# Altium schematic sheet PLEN_Control_Logic_pt2.SchDoc
size 420 x 594 mm; Author: ALTIUM GOSTBOM2.0 KEV
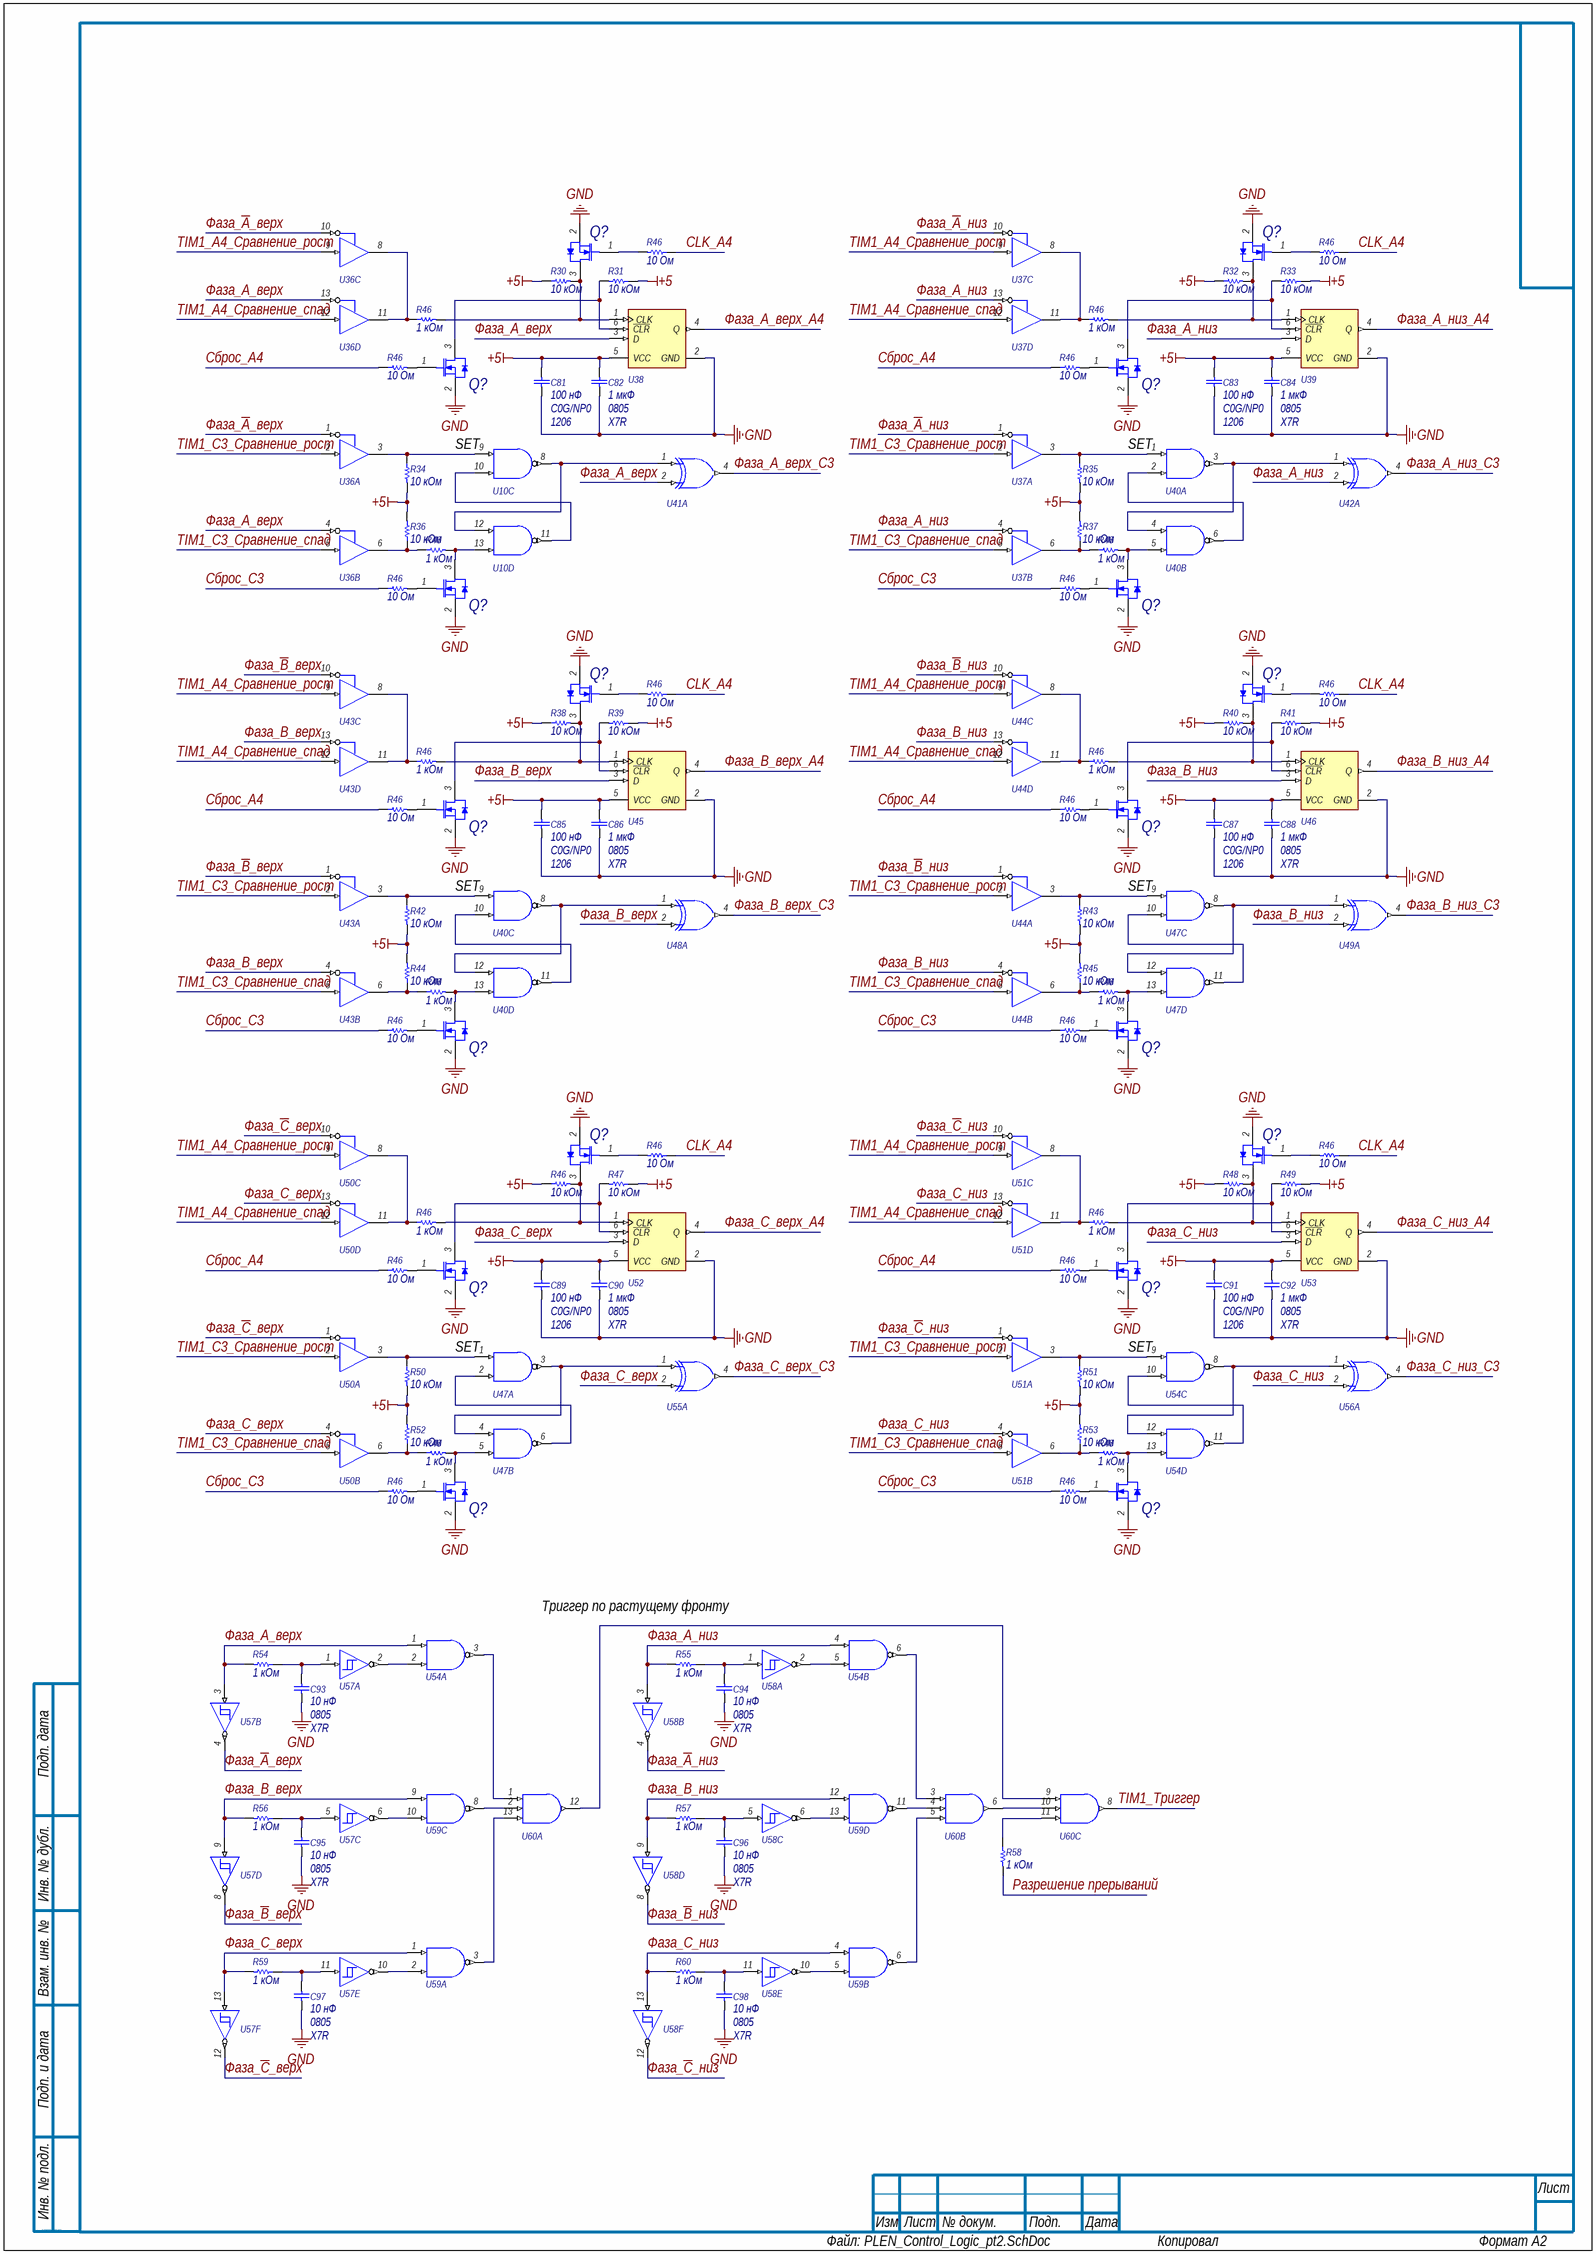
[diagram p0: PLEN_Control_Logic_pt2.SchDoc]

## Parts
(Parts that share a designator on the sheet are numbered #1, #2 ... from top to bottom, then left to right.)
C81  value 100 нФ  Dielectric Characteristic: C0G/NP0  Package Reference: 1206  [CAPC3216X180X55NL20T25]  (hidden comment: GRM31C5C1E104JA01L)
C82  value 1 мкФ  Case: 0805  Dielectric: X7R  [CAPC2013X140X50LL20T25]  (hidden comment: C0805C105K3RACTU)
C83  value 100 нФ  Dielectric Characteristic: C0G/NP0  Package Reference: 1206  [CAPC3216X180X55NL20T25]  (hidden comment: GRM31C5C1E104JA01L)
C84  value 1 мкФ  Case: 0805  Dielectric: X7R  [CAPC2013X140X50LL20T25]  (hidden comment: C0805C105K3RACTU)
C85  value 100 нФ  Dielectric Characteristic: C0G/NP0  Package Reference: 1206  [CAPC3216X180X55NL20T25]  (hidden comment: GRM31C5C1E104JA01L)
C86  value 1 мкФ  Case: 0805  Dielectric: X7R  [CAPC2013X140X50LL20T25]  (hidden comment: C0805C105K3RACTU)
C87  value 100 нФ  Dielectric Characteristic: C0G/NP0  Package Reference: 1206  [CAPC3216X180X55NL20T25]  (hidden comment: GRM31C5C1E104JA01L)
C88  value 1 мкФ  Case: 0805  Dielectric: X7R  [CAPC2013X140X50LL20T25]  (hidden comment: C0805C105K3RACTU)
C89  value 100 нФ  Dielectric Characteristic: C0G/NP0  Package Reference: 1206  [CAPC3216X180X55NL20T25]  (hidden comment: GRM31C5C1E104JA01L)
C90  value 1 мкФ  Case: 0805  Dielectric: X7R  [CAPC2013X140X50LL20T25]  (hidden comment: C0805C105K3RACTU)
C91  value 100 нФ  Dielectric Characteristic: C0G/NP0  Package Reference: 1206  [CAPC3216X180X55NL20T25]  (hidden comment: GRM31C5C1E104JA01L)
C92  value 1 мкФ  Case: 0805  Dielectric: X7R  [CAPC2013X140X50LL20T25]  (hidden comment: C0805C105K3RACTU)
C93  value 10 нФ  Case: 0805  Dielectric: X7R  [CAPC2013X140X50LL20T25]  (hidden comment: C0805C105K3RACTU)
C94  value 10 нФ  Case: 0805  Dielectric: X7R  [CAPC2013X140X50LL20T25]  (hidden comment: C0805C105K3RACTU)
C95  value 10 нФ  Case: 0805  Dielectric: X7R  [CAPC2013X140X50LL20T25]  (hidden comment: C0805C105K3RACTU)
C96  value 10 нФ  Case: 0805  Dielectric: X7R  [CAPC2013X140X50LL20T25]  (hidden comment: C0805C105K3RACTU)
C97  value 10 нФ  Case: 0805  Dielectric: X7R  [CAPC2013X140X50LL20T25]  (hidden comment: C0805C105K3RACTU)
C98  value 10 нФ  Case: 0805  Dielectric: X7R  [CAPC2013X140X50LL20T25]  (hidden comment: C0805C105K3RACTU)
Q?#1  2N7002  [INF-PG-SOT23_N]  (value not drawn)
Q?#2  2N7002  [INF-PG-SOT23_N]  (value not drawn)
Q?#3  2N7002  [INF-PG-SOT23_N]  (value not drawn)
Q?#4  2N7002  [INF-PG-SOT23_N]  (value not drawn)
Q?#5  2N7002  [INF-PG-SOT23_N]  (value not drawn)
Q?#6  2N7002  [INF-PG-SOT23_N]  (value not drawn)
Q?#7  2N7002  [INF-PG-SOT23_N]  (value not drawn)
Q?#8  2N7002  [INF-PG-SOT23_N]  (value not drawn)
Q?#9  2N7002  [INF-PG-SOT23_N]  (value not drawn)
Q?#10  2N7002  [INF-PG-SOT23_N]  (value not drawn)
Q?#11  2N7002  [INF-PG-SOT23_N]  (value not drawn)
Q?#12  2N7002  [INF-PG-SOT23_N]  (value not drawn)
Q?#13  2N7002  [INF-PG-SOT23_N]  (value not drawn)
Q?#14  2N7002  [INF-PG-SOT23_N]  (value not drawn)
Q?#15  2N7002  [INF-PG-SOT23_N]  (value not drawn)
Q?#16  2N7002  [INF-PG-SOT23_N]  (value not drawn)
Q?#17  2N7002  [INF-PG-SOT23_N]  (value not drawn)
Q?#18  2N7002  [INF-PG-SOT23_N]  (value not drawn)
R30  value 10 кОм  [RESC2013X60X40ML20T25]  (hidden comment: ERA6AEB101V)
R31  value 10 кОм  [RESC2013X60X40ML20T25]  (hidden comment: ERA6AEB101V)
R32  value 10 кОм  [RESC2013X60X40ML20T25]  (hidden comment: ERA6AEB101V)
R33  value 10 кОм  [RESC2013X60X40ML20T25]  (hidden comment: ERA6AEB101V)
R34  value 10 кОм  [RESC2013X60X40ML20T25]  (hidden comment: ERA6AEB101V)
R35  value 10 кОм  [RESC2013X60X40ML20T25]  (hidden comment: ERA6AEB101V)
R36  value 10 кОм  [RESC2013X60X40ML20T25]  (hidden comment: ERA6AEB101V)
R37  value 10 кОм  [RESC2013X60X40ML20T25]  (hidden comment: ERA6AEB101V)
R38  value 10 кОм  [RESC2013X60X40ML20T25]  (hidden comment: ERA6AEB101V)
R39  value 10 кОм  [RESC2013X60X40ML20T25]  (hidden comment: ERA6AEB101V)
R40  value 10 кОм  [RESC2013X60X40ML20T25]  (hidden comment: ERA6AEB101V)
R41  value 10 кОм  [RESC2013X60X40ML20T25]  (hidden comment: ERA6AEB101V)
R42  value 10 кОм  [RESC2013X60X40ML20T25]  (hidden comment: ERA6AEB101V)
R43  value 10 кОм  [RESC2013X60X40ML20T25]  (hidden comment: ERA6AEB101V)
R44  value 10 кОм  [RESC2013X60X40ML20T25]  (hidden comment: ERA6AEB101V)
R45  value 10 кОм  [RESC2013X60X40ML20T25]  (hidden comment: ERA6AEB101V)
R46#1  value 10 Ом  [RESC2013X60X40ML20T25]  (hidden comment: ERA6AEB101V)
R46#2  value 10 Ом  [RESC2013X60X40ML20T25]  (hidden comment: ERA6AEB101V)
R46#3  value 1 кОм  [RESC2013X60X40ML20T25]  (hidden comment: ERA6AEB101V)
R46#4  value 1 кОм  [RESC2013X60X40ML20T25]  (hidden comment: ERA6AEB101V)
R46#5  value 10 Ом  [RESC2013X60X40ML20T25]  (hidden comment: ERA6AEB101V)
R46#6  value 10 Ом  [RESC2013X60X40ML20T25]  (hidden comment: ERA6AEB101V)
R46#7  value 1 кОм  [RESC2013X60X40ML20T25]  (hidden comment: ERA6AEB101V)
R46#8  value 1 кОм  [RESC2013X60X40ML20T25]  (hidden comment: ERA6AEB101V)
R46#9  value 10 Ом  [RESC2013X60X40ML20T25]  (hidden comment: ERA6AEB101V)
R46#10  value 10 Ом  [RESC2013X60X40ML20T25]  (hidden comment: ERA6AEB101V)
R46#11  value 10 Ом  [RESC2013X60X40ML20T25]  (hidden comment: ERA6AEB101V)
R46#12  value 10 Ом  [RESC2013X60X40ML20T25]  (hidden comment: ERA6AEB101V)
R46#13  value 1 кОм  [RESC2013X60X40ML20T25]  (hidden comment: ERA6AEB101V)
R46#14  value 1 кОм  [RESC2013X60X40ML20T25]  (hidden comment: ERA6AEB101V)
R46#15  value 10 Ом  [RESC2013X60X40ML20T25]  (hidden comment: ERA6AEB101V)
R46#16  value 10 Ом  [RESC2013X60X40ML20T25]  (hidden comment: ERA6AEB101V)
R46#17  value 1 кОм  [RESC2013X60X40ML20T25]  (hidden comment: ERA6AEB101V)
R46#18  value 1 кОм  [RESC2013X60X40ML20T25]  (hidden comment: ERA6AEB101V)
R46#19  value 10 Ом  [RESC2013X60X40ML20T25]  (hidden comment: ERA6AEB101V)
R46#20  value 10 Ом  [RESC2013X60X40ML20T25]  (hidden comment: ERA6AEB101V)
R46#21  value 10 Ом  [RESC2013X60X40ML20T25]  (hidden comment: ERA6AEB101V)
R46#22  value 10 Ом  [RESC2013X60X40ML20T25]  (hidden comment: ERA6AEB101V)
R46#23  value 10 кОм  [RESC2013X60X40ML20T25]  (hidden comment: ERA6AEB101V)
R46#24  value 1 кОм  [RESC2013X60X40ML20T25]  (hidden comment: ERA6AEB101V)
R46#25  value 1 кОм  [RESC2013X60X40ML20T25]  (hidden comment: ERA6AEB101V)
R46#26  value 10 Ом  [RESC2013X60X40ML20T25]  (hidden comment: ERA6AEB101V)
R46#27  value 10 Ом  [RESC2013X60X40ML20T25]  (hidden comment: ERA6AEB101V)
R46#28  value 1 кОм  [RESC2013X60X40ML20T25]  (hidden comment: ERA6AEB101V)
R46#29  value 1 кОм  [RESC2013X60X40ML20T25]  (hidden comment: ERA6AEB101V)
R46#30  value 10 Ом  [RESC2013X60X40ML20T25]  (hidden comment: ERA6AEB101V)
R46#31  value 10 Ом  [RESC2013X60X40ML20T25]  (hidden comment: ERA6AEB101V)
R47  value 10 кОм  [RESC2013X60X40ML20T25]  (hidden comment: ERA6AEB101V)
R48  value 10 кОм  [RESC2013X60X40ML20T25]  (hidden comment: ERA6AEB101V)
R49  value 10 кОм  [RESC2013X60X40ML20T25]  (hidden comment: ERA6AEB101V)
R50  value 10 кОм  [RESC2013X60X40ML20T25]  (hidden comment: ERA6AEB101V)
R51  value 10 кОм  [RESC2013X60X40ML20T25]  (hidden comment: ERA6AEB101V)
R52  value 10 кОм  [RESC2013X60X40ML20T25]  (hidden comment: ERA6AEB101V)
R53  value 10 кОм  [RESC2013X60X40ML20T25]  (hidden comment: ERA6AEB101V)
R54  value 1 кОм  [RESC2013X60X40ML20T25]  (hidden comment: ERA6AEB101V)
R55  value 1 кОм  [RESC2013X60X40ML20T25]  (hidden comment: ERA6AEB101V)
R56  value 1 кОм  [RESC2013X60X40ML20T25]  (hidden comment: ERA6AEB101V)
R57  value 1 кОм  [RESC2013X60X40ML20T25]  (hidden comment: ERA6AEB101V)
R58  value 1 кОм  [RESC2013X60X40ML20T25]  (hidden comment: ERA6AEB101V)
R59  value 1 кОм  [RESC2013X60X40ML20T25]  (hidden comment: ERA6AEB101V)
R60  value 1 кОм  [RESC2013X60X40ML20T25]  (hidden comment: ERA6AEB101V)
U10  SN74HC00DT  [D0014A_N]  (value not drawn)  (parts C,D of 5)
U36  SN74HC125DRG4  [D0014A_N]  (value not drawn)  (parts A,B,C,D of 5)
U37  SN74HC125DRG4  [D0014A_N]  (value not drawn)  (parts A,B,C,D of 5)
U38  SN74LVC1G175DCKR  [DCK0006A_N]  (value not drawn)
U39  SN74LVC1G175DCKR  [DCK0006A_N]  (value not drawn)
U40  SN74HC00DT  [D0014A_N]  (value not drawn)  (parts A,B,C,D of 5)
U41  SN74AHC1G86DBVR  [DBV0005A_N]  (value not drawn)  (part A of 2)
U42  SN74AHC1G86DBVR  [DBV0005A_N]  (value not drawn)  (part A of 2)
U43  SN74HC125DRG4  [D0014A_N]  (value not drawn)  (parts A,B,C,D of 5)
U44  SN74HC125DRG4  [D0014A_N]  (value not drawn)  (parts A,B,C,D of 5)
U45  SN74LVC1G175DCKR  [DCK0006A_N]  (value not drawn)
U46  SN74LVC1G175DCKR  [DCK0006A_N]  (value not drawn)
U47  SN74HC00DT  [D0014A_N]  (value not drawn)  (parts A,B,C,D of 5)
U48  SN74AHC1G86DBVR  [DBV0005A_N]  (value not drawn)  (part A of 2)
U49  SN74AHC1G86DBVR  [DBV0005A_N]  (value not drawn)  (part A of 2)
U50  SN74HC125DRG4  [D0014A_N]  (value not drawn)  (parts A,B,C,D of 5)
U51  SN74HC125DRG4  [D0014A_N]  (value not drawn)  (parts A,B,C,D of 5)
U52  SN74LVC1G175DCKR  [DCK0006A_N]  (value not drawn)
U53  SN74LVC1G175DCKR  [DCK0006A_N]  (value not drawn)
U54  SN74HC00DT  [D0014A_N]  (value not drawn)  (parts A,B,C,D of 5)
U55  SN74AHC1G86DBVR  [DBV0005A_N]  (value not drawn)  (part A of 2)
U56  SN74AHC1G86DBVR  [DBV0005A_N]  (value not drawn)  (part A of 2)
U57  SN74HC14DRG4  [D0014A_N]  (value not drawn)  (parts A,B,C,D,E,F of 7)
U58  SN74HC14DRG4  [D0014A_N]  (value not drawn)  (parts A,B,C,D,E,F of 7)
U59  SN74HC00DT  [D0014A_N]  (value not drawn)  (parts A,B,C,D of 5)
U60  CD74HC11M  [D0014A_N]  (value not drawn)  (parts A,B,C of 4)

## Nets
+5: C81.1 C82.2 C83.1 C84.2 C85.1 C86.2 C87.1 C88.2 C89.1 C90.2 C91.1 C92.2 R30.1 R31.1 R32.1 R33.1 R34.2 R35.2 R36.2 R37.2 R38.1 R39.1 R40.1 R41.1 R42.2 R43.2 R44.2 R45.2 R46#23.1 R47.1 R48.1 R49.1 R50.2 R51.2 R52.2 R53.2 U38.5(VCC) U39.5(VCC) U45.5(VCC) U46.5(VCC) U52.5(VCC) U53.5(VCC)
GND: C81.2 C82.1 C83.2 C84.1 C85.2 C86.1 C87.2 C88.1 C89.2 C90.1 C91.2 C92.1 C93.2 C94.2 C95.2 C96.2 C97.2 C98.2 Q?#1.2(SOURCE) Q?#2.2(SOURCE) Q?#3.2(SOURCE) Q?#4.2(SOURCE) Q?#5.2(SOURCE) Q?#6.2(SOURCE) Q?#7.2(SOURCE) Q?#8.2(SOURCE) Q?#9.2(SOURCE) Q?#10.2(SOURCE) Q?#11.2(SOURCE) Q?#12.2(SOURCE) Q?#13.2(SOURCE) Q?#14.2(SOURCE) Q?#15.2(SOURCE) Q?#16.2(SOURCE) Q?#17.2(SOURCE) Q?#18.2(SOURCE) U38.2(GND) U39.2(GND) U45.2(GND) U46.2(GND) U52.2(GND) U53.2(GND)
CLK_A4: R46#1.1 R46#2.1 R46#11.1 R46#12.1 R46#21.1 R46#22.1
TIM1_C3_Сравнение_рост: U36.2(1A) U37.2(1A) U43.2(1A) U44.2(1A) U50.2(1A) U51.2(1A)
TIM1_C3_Сравнение_спад: U36.5(2A) U37.5(2A) U43.5(2A) U44.5(2A) U50.5(2A) U51.5(2A)
TIM1_А4_Сравнение_рост: U36.9(3A) U37.9(3A) U43.9(3A) U44.9(3A) U50.9(3A) U51.9(3A)
TIM1_А4_Сравнение_спад: U36.12(4A) U37.12(4A) U43.12(4A) U44.12(4A) U50.12(4A) U51.12(4A)
TIM1_Триггер: U60.8(3Y)
Разрешение прерываний: R58.2
Сброс_A4: R46#5.1 R46#6.1 R46#15.1 R46#16.1 R46#26.1 R46#27.1
Сброс_C3: R46#9.1 R46#10.1 R46#19.1 R46#20.1 R46#30.1 R46#31.1
Фаза_~{A}_низ: U37.1(1~{OE}) U37.10(3~{OE})
Фаза_A_низ: U37.4(2~{OE}) U37.13(4~{OE}) U42.2(B)
Фаза_A_низ_A4: U39.4(Q)
Фаза_A_низ_C3: U42.4(Y)
Фаза_~{B}_верх: U43.1(1~{OE}) U43.10(3~{OE}) U57.8(~{4Y})
Фаза_~{B}_низ: U44.1(1~{OE}) U44.10(3~{OE}) U58.8(~{4Y})
Фаза_B_верх: R56.2 U43.4(2~{OE}) U43.13(4~{OE}) U45.3(D) U48.2(B) U57.9(4A) U59.9(3A)
Фаза_B_верх_A4: U45.4(Q)
Фаза_B_верх_C3: U48.4(Y)
Фаза_B_низ: R57.2 U44.4(2~{OE}) U44.13(4~{OE}) U46.3(D) U49.2(B) U58.9(4A) U59.12(4A)
Фаза_B_низ_A4: U46.4(Q)
Фаза_B_низ_C3: U49.4(Y)
Фаза_~{C}_верх: U50.1(1~{OE}) U50.10(3~{OE}) U57.12(~{6Y})
Фаза_~{C}_низ: U51.1(1~{OE}) U51.10(3~{OE}) U58.12(~{6Y})
Фаза_C_верх: R59.2 U50.4(2~{OE}) U50.13(4~{OE}) U52.3(D) U55.2(B) U57.13(6A) U59.1(1A)
Фаза_C_верх_A4: U52.4(Q)
Фаза_C_верх_C3: U55.4(Y)
Фаза_C_низ: R60.2 U51.4(2~{OE}) U51.13(4~{OE}) U53.3(D) U56.2(B) U58.13(6A) U59.4(2A)
Фаза_C_низ_A4: U53.4(Q)
Фаза_C_низ_C3: U56.4(Y)
Фаза_~{А}_верх: U36.1(1~{OE}) U36.10(3~{OE}) U57.4(~{2Y})
Фаза_~{А}_низ: U58.4(~{2Y})
Фаза_А_верх: R54.2 U36.4(2~{OE}) U36.13(4~{OE}) U38.3(D) U41.2(B) U54.1(1A) U57.3(2A)
Фаза_А_верх_A4: U38.4(Q)
Фаза_А_верх_C3: U41.4(Y)
Фаза_А_низ: R55.2 U39.3(D) U54.4(2A) U58.3(2A)
NetC93_1: C93.1 R54.1 U57.1(1A)
NetC94_1: C94.1 R55.1 U58.1(1A)
NetC95_1: C95.1 R56.1 U57.5(3A)
NetC96_1: C96.1 R57.1 U58.5(3A)
NetC97_1: C97.1 R59.1 U57.11(5A)
NetC98_1: C98.1 R60.1 U58.11(5A)
NetQ?#1_1: Q?#1.1(GATE) R46#1.2
NetQ?#1_3: Q?#1.3(DRAIN) R30.2 R46#3.2 U38.1(CLK)
NetQ?#2_1: Q?#2.1(GATE) R46#2.2
NetQ?#2_3: Q?#2.3(DRAIN) R32.2 R46#4.2 U39.1(CLK)
NetQ?#3_1: Q?#3.1(GATE) R46#5.2
NetQ?#3_3: Q?#3.3(DRAIN) R31.2 U38.6(~{CLR})
NetQ?#4_1: Q?#4.1(GATE) R46#6.2
NetQ?#4_3: Q?#4.3(DRAIN) R33.2 U39.6(~{CLR})
NetQ?#5_1: Q?#5.1(GATE) R46#9.2
NetQ?#5_3: Q?#5.3(DRAIN) R46#7.2 U10.13(4B)
NetQ?#6_1: Q?#6.1(GATE) R46#10.2
NetQ?#6_3: Q?#6.3(DRAIN) R46#8.2 U40.5(2B)
NetQ?#7_1: Q?#7.1(GATE) R46#11.2
NetQ?#7_3: Q?#7.3(DRAIN) R38.2 R46#13.2 U45.1(CLK)
NetQ?#8_1: Q?#8.1(GATE) R46#12.2
NetQ?#8_3: Q?#8.3(DRAIN) R40.2 R46#14.2 U46.1(CLK)
NetQ?#9_1: Q?#9.1(GATE) R46#15.2
NetQ?#9_3: Q?#9.3(DRAIN) R39.2 U45.6(~{CLR})
NetQ?#10_1: Q?#10.1(GATE) R46#16.2
NetQ?#10_3: Q?#10.3(DRAIN) R41.2 U46.6(~{CLR})
NetQ?#11_1: Q?#11.1(GATE) R46#19.2
NetQ?#11_3: Q?#11.3(DRAIN) R46#17.2 U40.13(4B)
NetQ?#12_1: Q?#12.1(GATE) R46#20.2
NetQ?#12_3: Q?#12.3(DRAIN) R46#18.2 U47.13(4B)
NetQ?#13_1: Q?#13.1(GATE) R46#21.2
NetQ?#13_3: Q?#13.3(DRAIN) R46#23.2 R46#24.2 U52.1(CLK)
NetQ?#14_1: Q?#14.1(GATE) R46#22.2
NetQ?#14_3: Q?#14.3(DRAIN) R46#25.2 R48.2 U53.1(CLK)
NetQ?#15_1: Q?#15.1(GATE) R46#26.2
NetQ?#15_3: Q?#15.3(DRAIN) R47.2 U52.6(~{CLR})
NetQ?#16_1: Q?#16.1(GATE) R46#27.2
NetQ?#16_3: Q?#16.3(DRAIN) R49.2 U53.6(~{CLR})
NetQ?#17_1: Q?#17.1(GATE) R46#30.2
NetQ?#17_3: Q?#17.3(DRAIN) R46#28.2 U47.5(2B)
NetQ?#18_1: Q?#18.1(GATE) R46#31.2
NetQ?#18_3: Q?#18.3(DRAIN) R46#29.2 U54.13(4B)
NetR34_1: R34.1 U10.9(3A) U36.3(1Y)
NetR35_1: R35.1 U37.3(1Y) U40.1(1A)
NetR36_1: R36.1 R46#7.1 U36.6(2Y)
NetR37_1: R37.1 R46#8.1 U37.6(2Y)
NetR42_1: R42.1 U40.9(3A) U43.3(1Y)
NetR43_1: R43.1 U44.3(1Y) U47.9(3A)
NetR44_1: R44.1 R46#17.1 U43.6(2Y)
NetR45_1: R45.1 R46#18.1 U44.6(2Y)
NetR46#3_1: R46#3.1 U36.8(3Y) U36.11(4Y)
NetR46#4_1: R46#4.1 U37.8(3Y) U37.11(4Y)
NetR46#13_1: R46#13.1 U43.8(3Y) U43.11(4Y)
NetR46#14_1: R46#14.1 U44.8(3Y) U44.11(4Y)
NetR46#24_1: R46#24.1 U50.8(3Y) U50.11(4Y)
NetR46#25_1: R46#25.1 U51.8(3Y) U51.11(4Y)
NetR46#28_1: R46#28.1 R52.1 U50.6(2Y)
NetR46#29_1: R46#29.1 R53.1 U51.6(2Y)
NetR50_1: R50.1 U47.1(1A) U50.3(1Y)
NetR51_1: R51.1 U51.3(1Y) U54.9(3A)
NetR58_1: R58.1 U60.11(3C)
NetU10_8: U10.8(3Y) U10.12(4A) U41.1(A)
NetU10_10: U10.10(3B) U10.11(4Y)
NetU40_2: U40.2(1B) U40.6(2Y)
NetU40_3: U40.3(1Y) U40.4(2A) U42.1(A)
NetU40_8: U40.8(3Y) U40.12(4A) U48.1(A)
NetU40_10: U40.10(3B) U40.11(4Y)
NetU47_2: U47.2(1B) U47.6(2Y)
NetU47_3: U47.3(1Y) U47.4(2A) U55.1(A)
NetU47_8: U47.8(3Y) U47.12(4A) U49.1(A)
NetU47_10: U47.10(3B) U47.11(4Y)
NetU54_2: U54.2(1B) U57.2(~{1Y})
NetU54_3: U54.3(1Y) U60.1(1A)
NetU54_5: U54.5(2B) U58.2(~{1Y})
NetU54_6: U54.6(2Y) U60.3(2A)
NetU54_8: U54.8(3Y) U54.12(4A) U56.1(A)
NetU54_10: U54.10(3B) U54.11(4Y)
NetU57_6: U57.6(~{3Y}) U59.10(3B)
NetU57_10: U57.10(~{5Y}) U59.2(1B)
NetU58_6: U58.6(~{3Y}) U59.13(4B)
NetU58_10: U58.10(~{5Y}) U59.5(2B)
NetU59_3: U59.3(1Y) U60.13(1C)
NetU59_6: U59.6(2Y) U60.5(2C)
NetU59_8: U59.8(3Y) U60.2(1B)
NetU59_11: U59.11(4Y) U60.4(2B)
NetU60_6: U60.6(2Y) U60.10(3B)
NetU60_9: U60.9(3A) U60.12(1Y)

## Notes on the sheet
- (near U10) SET
- (near U40) SET
- (near U47) SET
- (near U54) SET
- Триггер по растущему фронту
- Подп. дата
- Инв. № дубл.
- Взам. инв. №
- Подп. и дата
- Инв. № подл.
- Изм.
- Лист
- № докум.
- Подп.
- Дата
- ALTIUM GOSTBOM2.0 KEV
- Файл:
- Копировал
- Формат А2

## Library data of the parts
C81 C83 C85 C87 C89 C91 = CMP-2000-06343-1: Chip Capacitor, 100 nF, +/- 5%, 25 V, -55 to 125 degC, 1206 (3216 Metric), RoHS, Tape and Reel; Manufacturer: Murata; External Width: 0.5mm; Voltage Rating V DC: 25V; Capacitor Case Style: 1206[3216Metric]; Insulation Resistance: 10000Mohm; Capacitor Terminals: SMD; Temperature Coefficient: 0ppm/°C±30ppm/°C; External Length / Height: 1mm; Reel Quantity: 2000; SVHC: NoSVHC(19-Dec-2012); No. of Pins: 2; Manufacturer URL: http://www.murata.com/; Mounting Technology: SurfaceMount; Operating Temperature Range: -55°Cto+125°C; Operating Temperature Max: 125°C; Package Description: 2-Pin Surface Mount Device, Body 3.2 x 1.6 mm; Operating Temperature Min: -55°C; Terminal Type: SurfaceMount(SMD,SMT); MSL: –; Tolerance +: 5%; Voltage Rating: 25V; Datasheet URL: https://datasheet.ciiva.com/3777/11308grm31c5c1e104ja0123-3777177.pdf; Datasheet Version: 09/2014; Package / Case: 1206; Capacitance Tolerance: ±5%; Lead Spacing: –; Tolerance -: 5%
C82 C84 C86 C88 C90 C92-C98 = CMP-2007-03234-1: Manufacturer: Kemet; Part Number: C0805C105K3RACTU
Q?#1-Q?#18 = CMP-1149-00026-1: N-Channel OptiMOS Small-Signal-Transistor, 60 V VDS, 0.3 A ID, -55 to 150 degC, PG-SOT23, Reel, Green; Manufacturer: Infineon; RDS (on) (max) (@4.5V): 4,000 mOhm; VDS (max): 60 V; IDpuls (max): 1.2Â A; QG: 0.4Â nC; RDS (on) (max): 3,000 mOhm; RthJA (max): 250 K/W; ID (max): 0.3Â A; VGS(th) (max): 2.5Â V; VGS(th) (min): 1.5Â V; Green: TRUE; Ptot (max): 0.5Â W; PackageDescription: 3-Pin Small Outline Transistor Package, 2.9 x 1.3 mm Body, 0.95 mm Pitch; Halogen-free: TRUE; ComponentLink2Description: Datasheet; ComponentLink1URL: http://www.infineon.com/; Packing: Reel; DatasheetVersion: Rev. 2.4; PartNumber: 2N7002; PackageReference: PG-SOT23; PackageVersion: Apr-08; ComponentLink3URL: http://www.infineon.com/dgdl/SOT23-Package_Overview.pdf?folderId=db3a30431936bc4b0119532290053c66&fileId=db3a30431936bc4b0119533468123c85; ComponentLink1Description: Manufacturer URL; Mounting Technology: Surface Mount; ComponentLink3Description: Package Specification; ComponentLink2URL: http://www.infineon.com/dgdl/2N7002_Rev2.4.pdf?folderId=db3a3043156fd573011622e10b5c1f67&fileId=db3a304319bc939a0119c2a9461e79e6
R30-R45 R46#1-R46#31 R47-R60 = CMP-2001-00580-1: Manufacturer: Panasonic; Part Number: ERA6AEB101V
U10 U40 U47 U54 U59 = CMP-1627-00178-2: Quad 2-Input Positive-NAND Gates, D0014A, SMALL T&R; Manufacturer: Texas Instruments; Rating: Catalog; F @ Nom Voltage(Max)(Mhz): 70; VCC(Max)(V): 6; tpd @ Nom Voltage(Max)(ns): 23; VCC(Min)(V): 2; Schmitt Trigger: Yes; Output Drive (IOL/IOH)(Max)(mA): 5.2/-5.2; Voltage(Nom)(V): 5; Technology Family: HC; Output Type: CMOS; Bits(#): 4; ICC @ Nom Voltage(Max)(mA): 0.02; Operating Temperature Range(C): -40 to 85; DatasheetVersion: SCLS181E; PackageReference: D0014A; Code_JEDEC: MS-012; Generic Part Number: SN74HC00; Input Type: CMOS
U36 U37 U43 U44 U50 U51 = CMP-0440-00033-3: Quadruple Bus Buffer Gates With 3-State Outputs, D0014A, LARGE T&R; Manufacturer: Texas Instruments; ICC @ Nom Voltage(Max)(mA): 0.16; F @ Nom Voltage(Max)(Mhz): 28; Rating: Catalog; Input Type: CMOS; VCC(Min)(V): 2; VCC(Max)(V): 6; Bits(#): 4; tpd @ Nom Voltage(Max)(ns): 26; Generic Part Number: SN74HC125; Output Type: CMOS; DatasheetVersion: SCLS104D; PackageReference: D0014A; PackageVersion: http://www.ti.com/lit/ml/mpds177g/mpds177g.pdf; Operating Temperature Range(C): -40 to 85; Voltage(Nom)(V): 6; Code_JEDEC: MS-012
U38 U39 U45 U46 U52 U53 = CMP-0859-00488-3: Single D-Type Flip-Flop with Asynchronous Clear, DCK0006A, LARGE T&R; Manufacturer: Texas Instruments; ICC @ Nom Voltage(Max)(mA): 0.01; Output Type: CMOS; Voltage(Nom)(V): 1.8,2.5,3.3,5; Rating: Catalog; Technology Family: LVC; tpd @ Nom Voltage(Max)(ns): 13.4,7.1,5.7,4; Schmitt Trigger: No; Logic: True; VCC(Max)(V): 5.5; F @ Nom Voltage(Max)(Mhz): 150; VCC(Min)(V): 1.65; Bits(#): 1; Output Drive (IOL/IOH)(Max)(mA): 32/-32; Input Type: CMOS/TTL; Generic Part Number: SN74LVC1G175; 3-State Output: No; PackageReference: DCK0006A; DatasheetVersion: SCES560F; Operating Temperature Range(C): -40 to 125,-40 to 85; Sub-Family: D-Type Flip-Flop
U41 U42 U48 U49 U55 U56 = CMP-0859-00164-3: Single 2-Input Exclusive-OR Gate, DBV0005A, LARGE T&R; Manufacturer: Texas Instruments; Input Type: CMOS; Sub-Family: XOR Gate; Logic: True; F @ Nom Voltage(Max)(Mhz): 75; Schmitt Trigger: No; VCC(Min)(V): 2; Bits(#): 1; Voltage(Nom)(V): 3.3,5; Gate Type: XOR; VCC(Max)(V): 5.5; Rating: Catalog; ICC @ Nom Voltage(Max)(mA): 0.01; tpd @ Nom Voltage(Max)(ns): 14.5,8.8; Output Drive (IOL/IOH)(Max)(mA): 50/-50; Technology Family: AHC; DatasheetVersion: SCLS323N; Generic Part Number: SN74AHC1G86; Output Type: CMOS; PackageReference: DBV0005A; Operating Temperature Range(C): -40 to 125; 3-State Output: No
U57 U58 = CMP-1615-00271-3: Hex Schmitt-Trigger Inverters, D0014A, LARGE T&R; Manufacturer: Texas Instruments; ICC @ Nom Voltage(Max)(mA): 0.02; VCC(Max)(V): 6; VCC(Min)(V): 2; Rating: Catalog; Technology Family: HC; Input Type: CMOS; Voltage(Nom)(V): 5; F @ Nom Voltage(Max)(Mhz): 20; Output Drive (IOL/IOH)(Max)(mA): -4/4; Schmitt Trigger: Yes; tpd @ Nom Voltage(Max)(ns): 31; PackageReference: D0014A; Generic Part Number: SN74HC14; Bits(#): 6; DatasheetVersion: SCLS085G; Output Type: CMOS; Code_JEDEC: MS-012; Operating Temperature Range(C): -40 to 85
U60 = CMP-0777-00088-3: High Speed CMOS Logic Triple 3-Input AND Gates, D0014A, TUBE; Manufacturer: Texas Instruments; Schmitt Trigger: No; tpd @ Nom Voltage(Max)(ns): 25; Technology Family: HC; Rating: Catalog; F @ Nom Voltage(Max)(Mhz): 70; Bits(#): 3; Output Drive (IOL/IOH)(Max)(mA): -5.2/5.2; ICC @ Nom Voltage(Max)(mA): 0.02; Voltage(Nom)(V): 5; VCC(Max)(V): 6; VCC(Min)(V): 2; Output Type: CMOS; Input Type: CMOS; Generic Part Number: CD74HC11; Operating Temperature Range(C): -55 to 125; DatasheetVersion: SCHS273E; PackageReference: D0014A